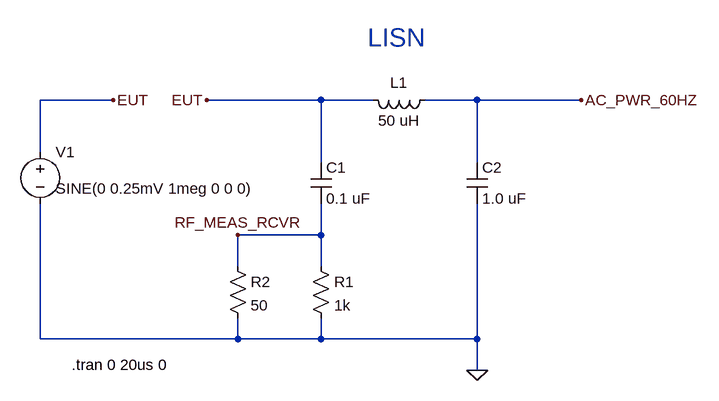
[diagram p0: schematic hw1_p3c_eantunano.asc]
hw1_p3c_eantunano.asc, the LTspice schematic file:
Version 4
SHEET 1 880 680
WIRE -224 -384 -336 -384
WIRE 96 -384 -80 -384
WIRE 176 -384 96 -384
WIRE 336 -384 256 -384
WIRE 496 -384 336 -384
WIRE -336 -304 -336 -384
WIRE 96 -288 96 -384
WIRE 336 -288 336 -384
WIRE 96 -176 96 -224
WIRE 96 -176 -32 -176
WIRE -32 -128 -32 -176
WIRE 96 -128 96 -176
WIRE -336 -16 -336 -224
WIRE -32 -16 -32 -48
WIRE -32 -16 -336 -16
WIRE 96 -16 96 -48
WIRE 96 -16 -32 -16
WIRE 336 -16 336 -224
WIRE 336 -16 96 -16
WIRE 336 32 336 -16
FLAG 336 32 0
FLAG -80 -384 EUT
FLAG -224 -384 EUT
FLAG 496 -384 AC_PWR_60HZ
FLAG -32 -176 RF_MEAS_RCVR
SYMBOL res 80 -144 R0
SYMATTR InstName R1
SYMATTR Value 1k
SYMBOL cap 80 -288 R0
SYMATTR InstName C1
SYMATTR Value 0.1 uF
SYMBOL cap 320 -288 R0
SYMATTR InstName C2
SYMATTR Value 1.0 uF
SYMBOL ind 272 -400 R90
WINDOW 0 5 56 VBottom 2
WINDOW 3 32 56 VTop 2
SYMATTR InstName L1
SYMATTR Value 50 uH
SYMBOL res -48 -144 R0
SYMATTR InstName R2
SYMATTR Value 50
SYMBOL voltage -336 -320 R0
WINDOW 123 24 44 Left 2
WINDOW 39 0 0 Left 0
WINDOW 3 24 72 Left 2
SYMATTR Value SINE(0 0.25mV 1meg 0 0 0)
SYMATTR InstName V1
TEXT 168 -480 Left 4 ;LISN
TEXT -288 24 Left 2 !.tran 0 20us 0

The netlist it stands for:
* hw1_p3c_eantunano.asc
R1 RF_MEAS_RCVR 0 1k
C1 EUT RF_MEAS_RCVR 0.1 uF
C2 AC_PWR_60HZ 0 1.0 uF
L1 AC_PWR_60HZ EUT 50 uH
R2 RF_MEAS_RCVR 0 50
V1 EUT 0 SINE(0 0.25mV 1meg 0 0 0)
* LISN
.tran 0 20us 0
.backanno
.end